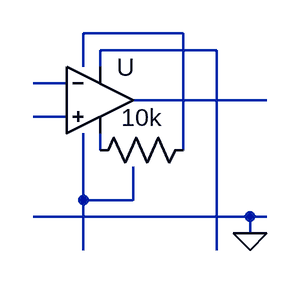
[diagram p0: schematic Offset.asc]
Offset.asc, the LTspice schematic file:
Version 4
SHEET 1 880 680
WIRE 240 80 144 80
WIRE 272 96 160 96
WIRE 144 112 144 80
WIRE 160 112 160 96
WIRE 128 128 96 128
WIRE 320 144 192 144
WIRE 128 160 96 160
WIRE 160 192 160 176
WIRE 240 192 240 80
WIRE 144 240 144 176
WIRE 192 240 192 208
WIRE 192 240 144 240
WIRE 304 256 96 256
WIRE 320 256 304 256
WIRE 304 272 304 256
WIRE 144 288 144 240
WIRE 272 288 272 96
FLAG 304 272 0
SYMBOL Opamps\\opamp2 160 80 R0
SYMATTR InstName U
SYMATTR Value ""
SYMBOL res 256 176 R90
WINDOW 0 0 56 VBottom 2
WINDOW 3 32 56 VTop 2
SYMATTR InstName 10k
SYMATTR Value ""

The netlist it stands for:
* Offset.asc
XU N005 N003 N002 N006 N004 opamp2  ; pins In+ In- V+ V- OUT
R§10k N001 N006
.backanno
.end